# Altium schematic sheet NF-03.schdoc
size 55 x 43 mm
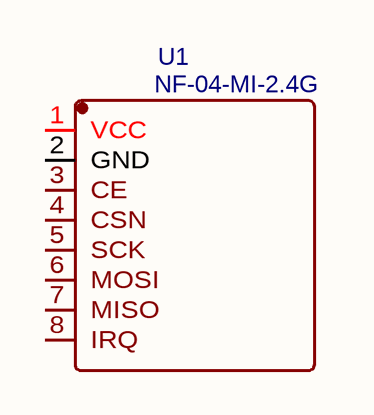
[diagram p0: NF-03.schdoc]

## Parts
U1  NF-04-MI-2.4G  [NF-04-MI-2.4G]

## Nets

Not connected (* = marked no-connect by the designer): U1 1(VCC) 2(GND) 3(CE) 4(CSN) 5(SCK) 6(MOSI) 7(MISO) 8(IRQ)

## Library data of the parts
U1 = NF-04-MI-2.4G: BOM_Manufacturer: Ai-Thinker; Contributor: LCSC; BOM_Supplier: LCSC; BOM_Supplier Part: C129093; BOM_Manufacturer Part: NF-04-MI-2.4G; spicePre: U